# Altium schematic sheet CURRENT_SOURCE.SchDoc
size 420 x 297 mm; SheetNumber: 5; SheetTotal: 7
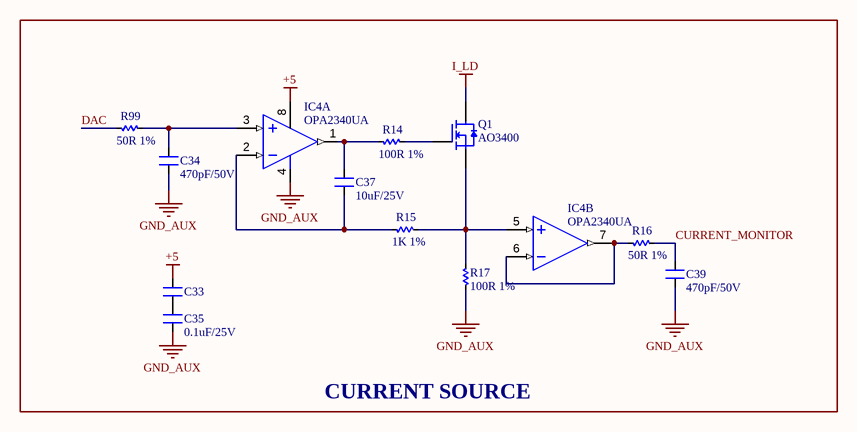
[diagram p0: CURRENT_SOURCE.SchDoc]

## Parts
C33  0.1uF/25V  [SM-0603]  (value not drawn)
C34  470pF/50V  [SM-0603]
C35  0.1uF/25V  [SM-0603]
C37  10uF/25V  [SM-0603]
C39  470pF/50V  [SM-0603]
IC4  OPA2340UA  [SO8]  (parts A,B of 2)
Q1  AO3400  [SOT23-132]
R14  100R 1%  [RES-SMD-0603]
R15  1K 1%  [RES-SMD-0603]
R16  50R 1%  [RES-SMD-0603]
R17  100R 1%  [RES-SMD-0603]
R99  50R 1%  [RES-SMD-0603]

## Blocks framed on the sheet
CURRENT SOURCE: C33-C35 C37 C39 IC4 Q1 R14-R17 R99

## Nets
+5: C33.2 IC4.8(+V)
GND_AUX: C34.1 C35.1 C39.1 IC4.4(-V) R17.1
I_LD: Q1.3
CURRENT_MONITOR: C39.2 R16.2
DAC: R99.1
NetC33_1: C33.1 C35.2
NetC34_2: C34.2 IC4.3(IN+) R99.2
NetC37_1: C37.1 IC4.2(IN-) R15.1
NetC37_2: C37.2 IC4.1(OUT) R14.1
NetIC4_5: IC4.5(IN+) Q1.2 R15.2 R17.2
NetIC4_6: IC4.6(IN-) IC4.7(OUT) R16.1
NetQ1_1: Q1.1 R14.2

## Notes on the sheet
- Project:
- BEE-PC1
- Sub-system:
- Design by:
- Hung Nguyen D.
- Bao Bui Q.
- Sheet title:
- Sheet
- A3
- of
- Checked by:
- Approved by:
- Vu Pham
- Revision:
- Document No:
- V1.0.0
- Size:
- Date:

## Library data of the parts
C33-C35 C37 C39 = CM: 0603; Value: 103
IC4 = LM358: 8SOIC; Value: LM358
Q1 = FET-N
R14-R17 R99 = Res-SMD: 0603; Manufacturer: Generic Components; Class: Passive; Published: 08/06/2000; Publisher: Altium Hobart Technology Centre